# EAGLE schematic BEP33_rev1 (EAGLE 7.7.0)

## Sheet 1 of 3
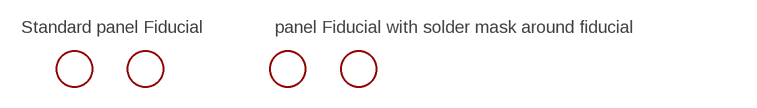
[diagram p0: schematic, sheet 1]

### Parts
FID1  FIDUCIAL  [FIDUCIAL_1MM]
FID1B  FIDUCIALFIDUCIAL_1MM_WITH_SOLDERMASK  [FIDUCIAL_1MM_WITH_SOLDERMASK]
FID2  FIDUCIAL  [FIDUCIAL_1MM]
FID2B  FIDUCIALFIDUCIAL_1MM_WITH_SOLDERMASK  [FIDUCIAL_1MM_WITH_SOLDERMASK]

### Notes on the sheet
- Standard panel Fiducial | panel Fiducial with solder mask around fiducial

## Sheet 2 of 3
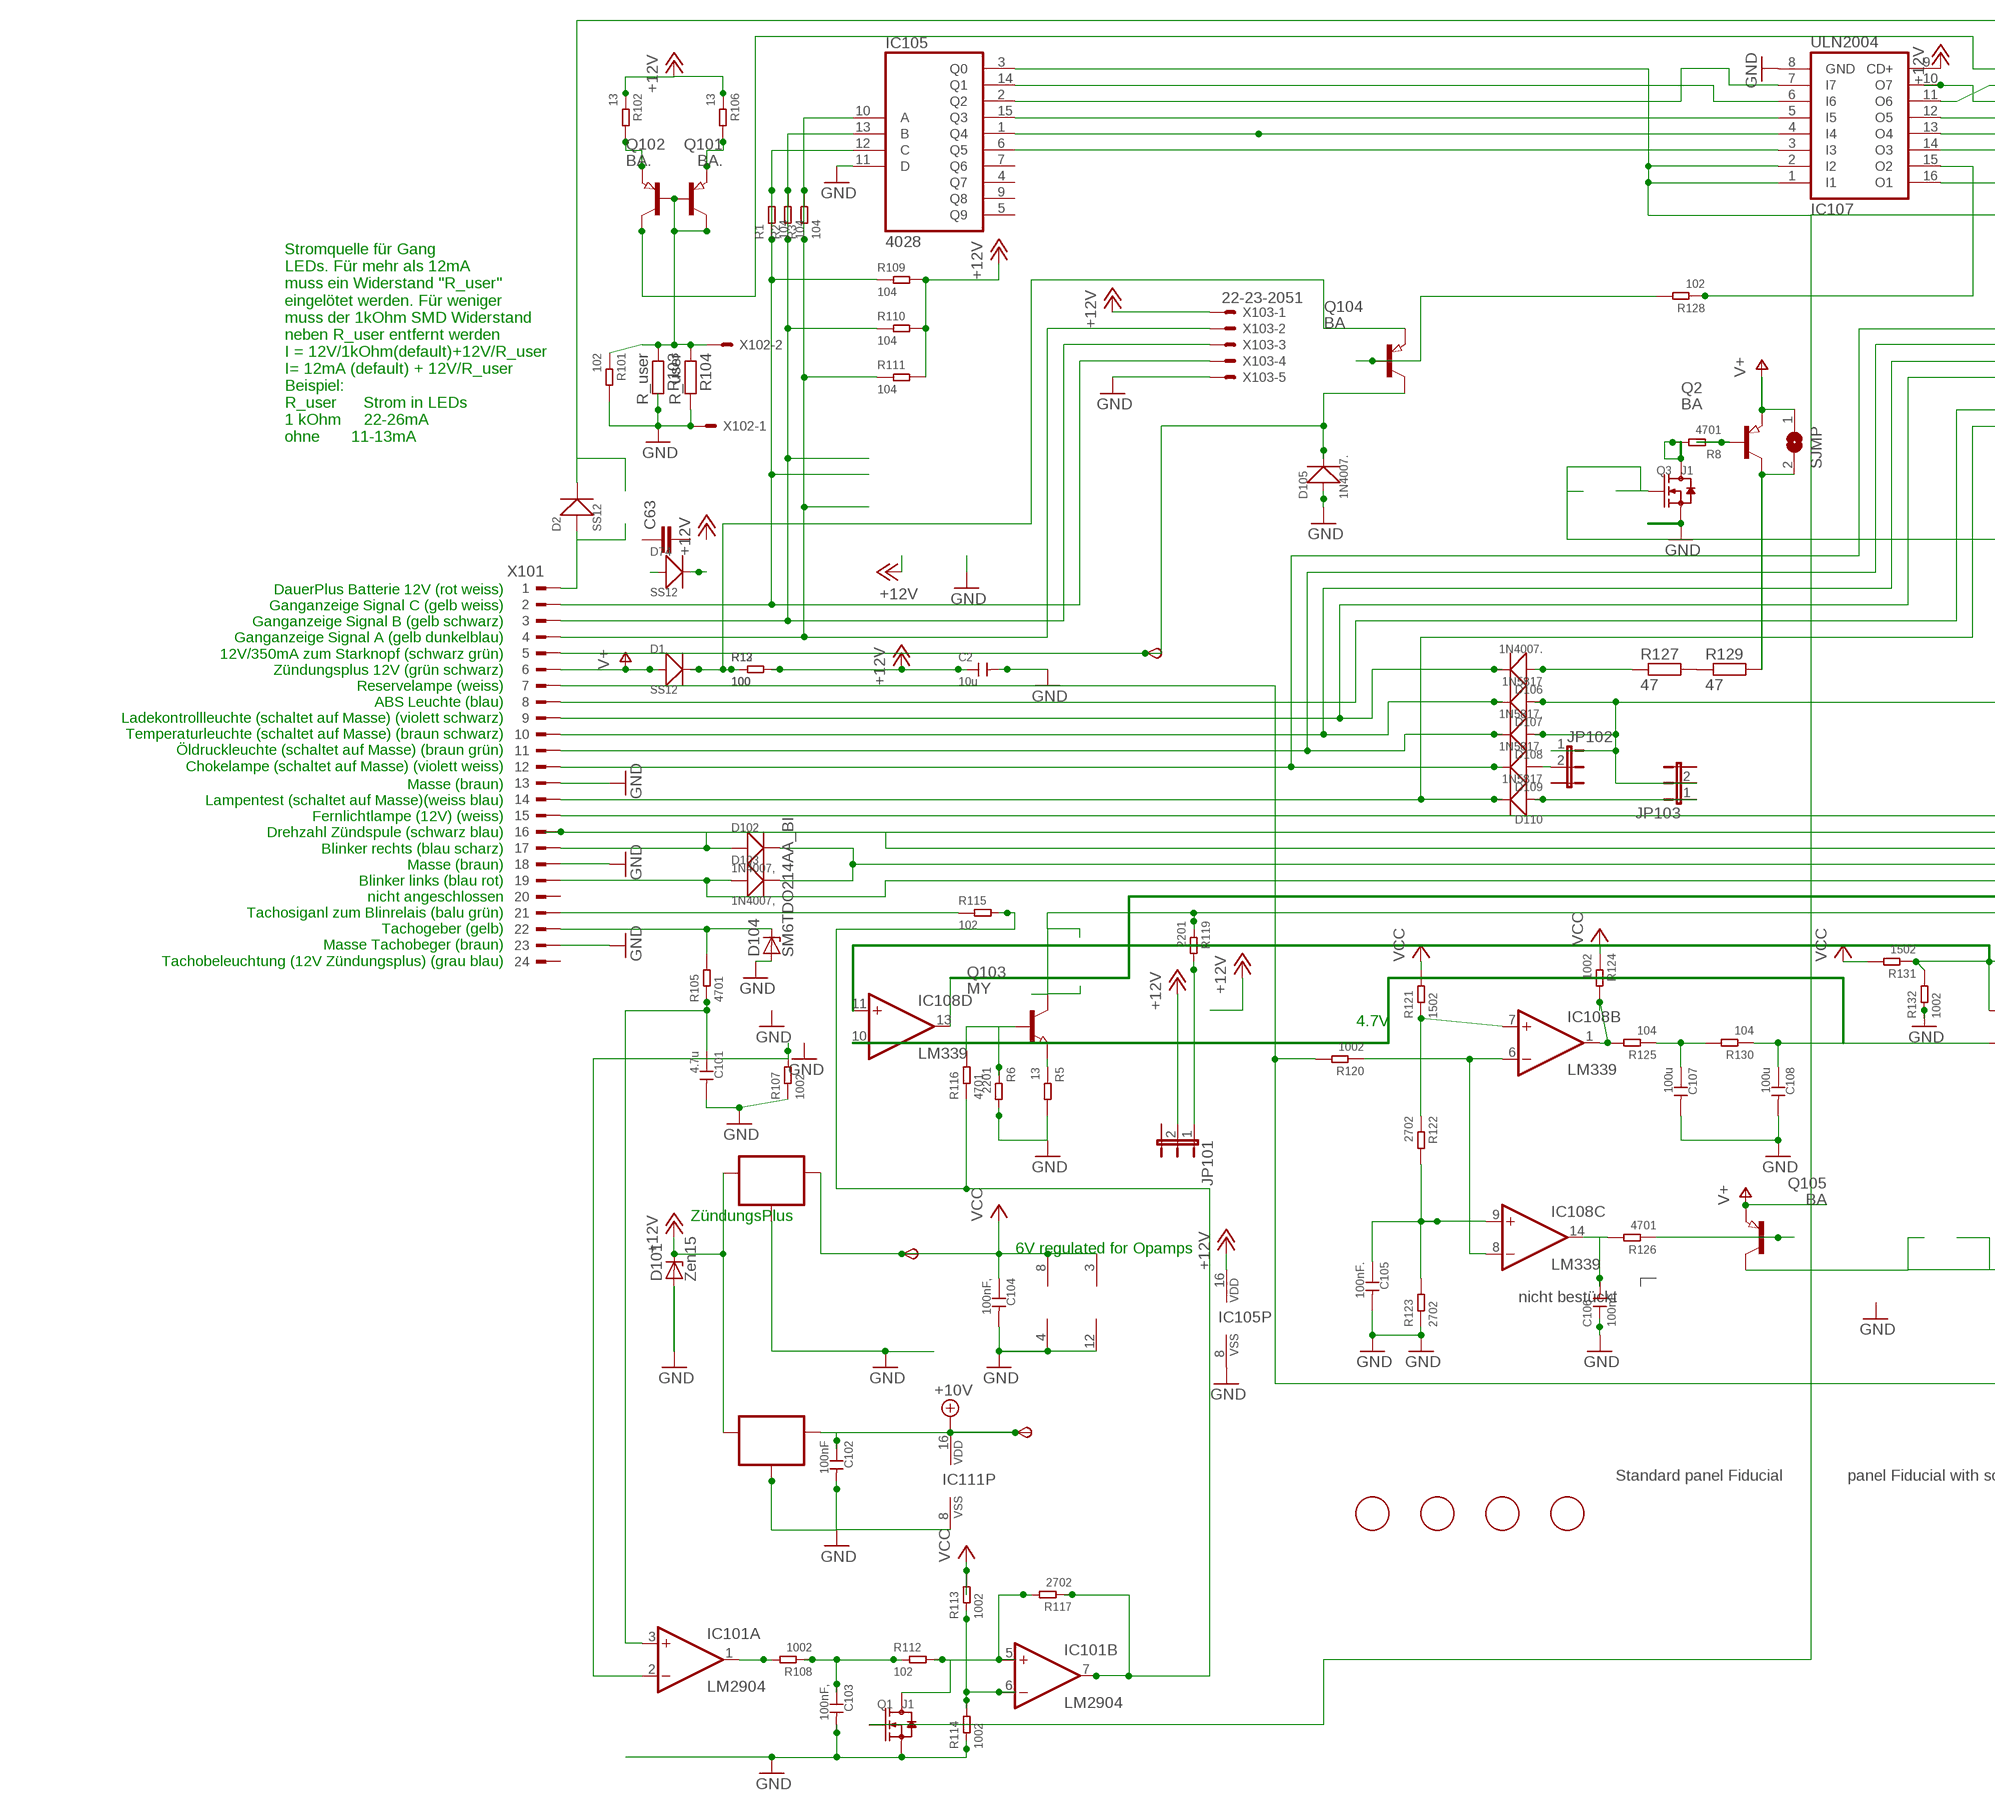
[diagram p1: schematic, sheet 2, part 1 of 2]
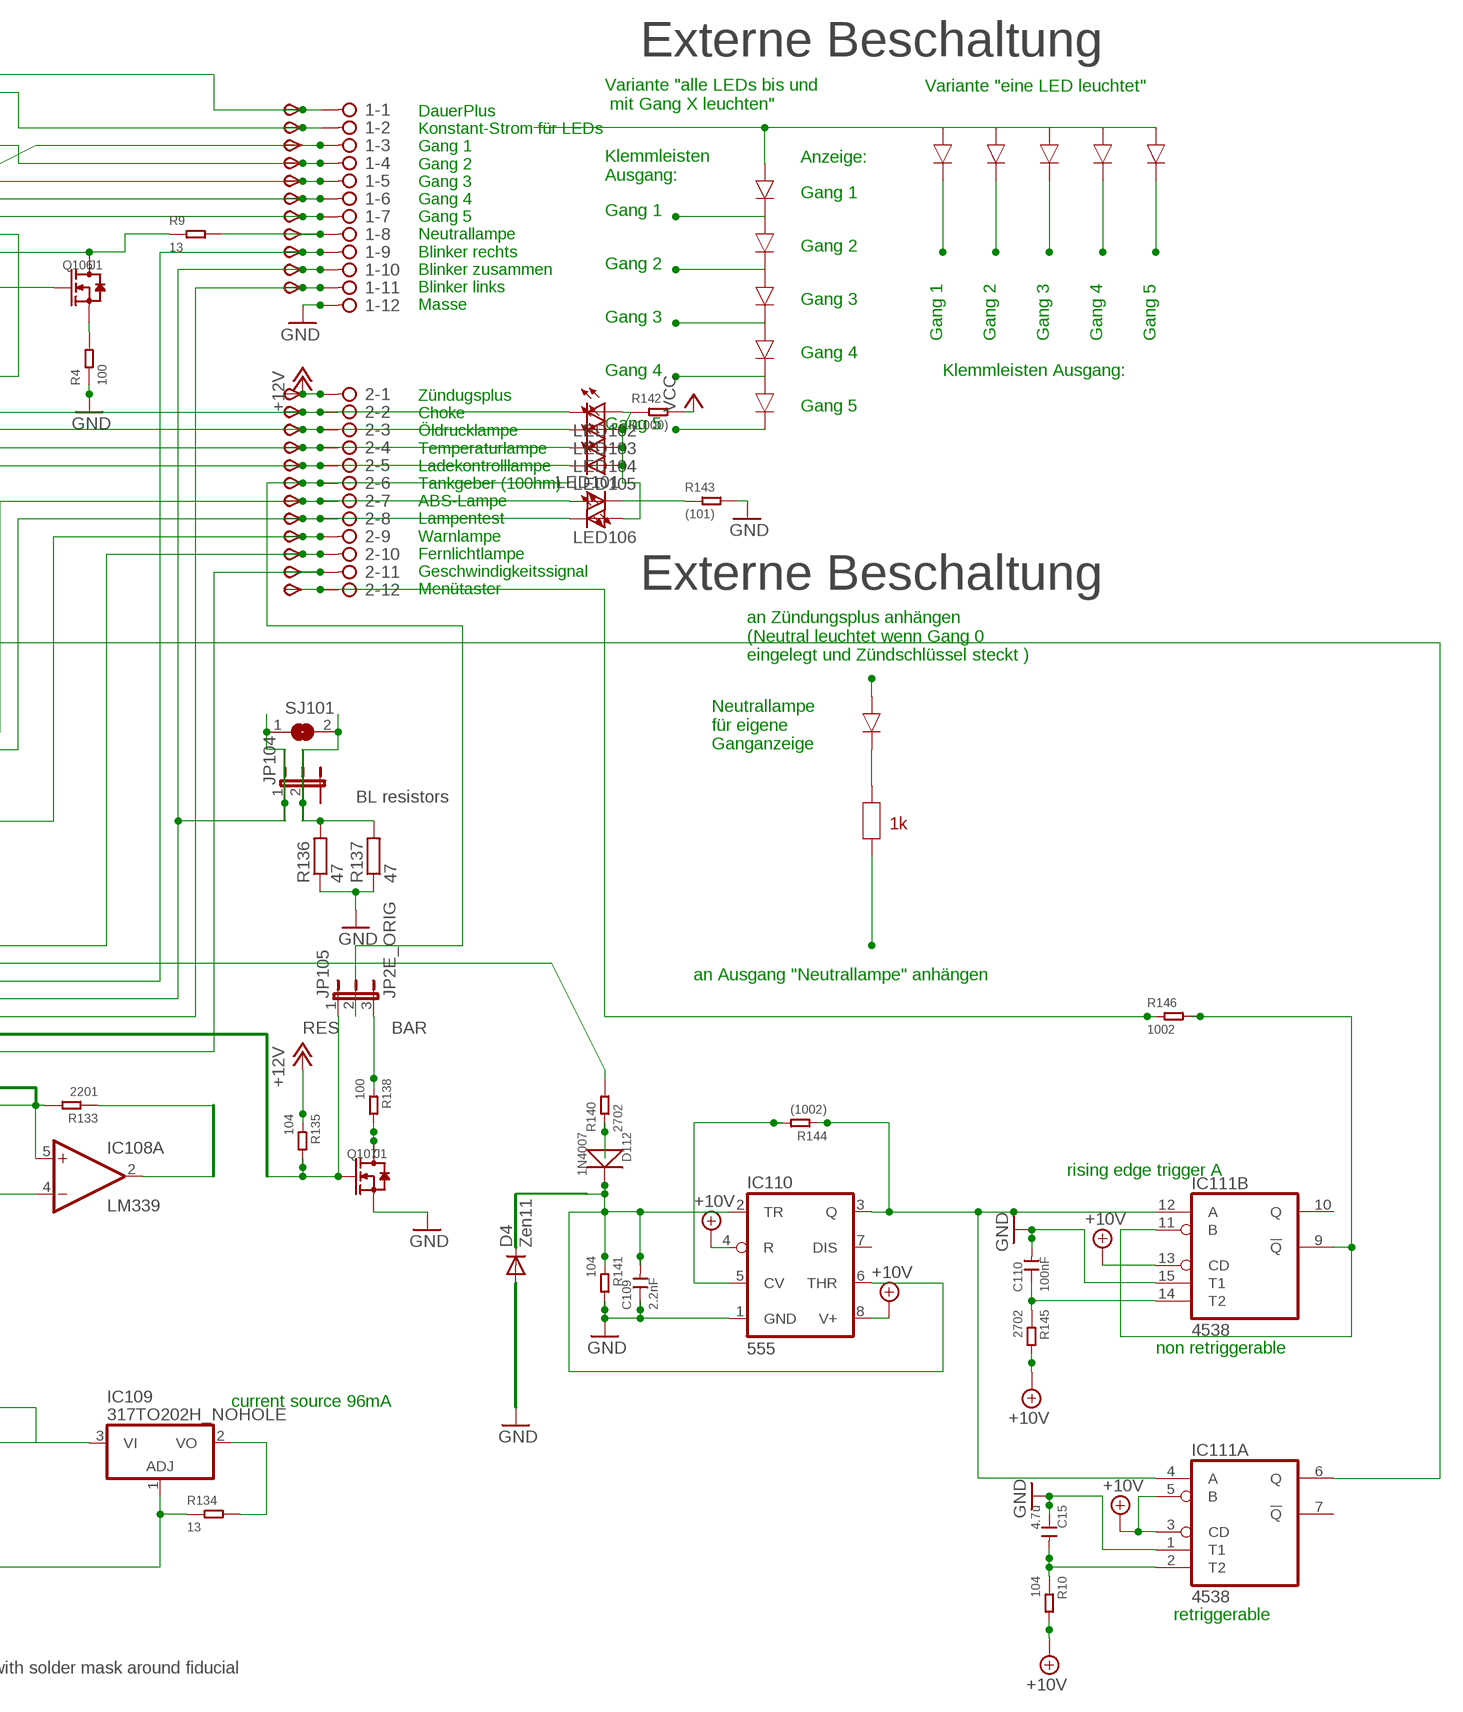
[diagram p2: schematic, sheet 2, part 2 of 2]

### Parts
1  2081-1132  [12-PIN]
2  2081-1132  [12-PIN]
6V  TPSB2.0  [B2.0]
10V  TPSB2.0  [B2.0]
C2  10u  CERAMIC-100UF-6.3V-20%-X5R(1206)  [C1206]
C15  4.7u  CERAMIC-4.7UF-25V-10%-X5R(0805)  [C0805]
C63  C-EUC1812K  [C1812K]
C101  4.7u  CERAMIC-4.7UF-25V-10%-X5R(0805)  [C0805]
C102  100nF  CERAMIC-100NF-50V-10%-X7R(0805)  [C0805]
C103  100nF,  CERAMIC-100NF-50V-10%-X7R(0805)  [C0805]
C104  100nF,  CERAMIC-100NF-50V-10%-X7R(0805)  [C0805]
C105  100nF.  CERAMIC-100NF-50V-10%-X7R(0805)  [C0805]
C106  100nF.  CERAMIC-100NF-50V-10%-X7R(0805)  [C0805]
C107  100u  CERAMIC-100UF-6.3V-20%-X5R(1206)  [C1206]
C108  100u  CERAMIC-100UF-6.3V-20%-X5R(1206)  [C1206]
C109  2.2nF  CERAMIC-100NF-50V-10%-X7R(0805)  [C0805]
C110  100nF  CERAMIC-100NF-50V-10%-X7R(0805)  [C0805]
D1  SS12  DIODE-GEN-PURPOSE-1KV-1A(DO-214AC)DO-214AC/1206  [DO-214AC_SLIM]
D2  SS12  DIODE-GEN-PURPOSE-1KV-1A(DO-214AC)DO-214AC/1206  [DO-214AC_SLIM]
D4  Zen11  CGRM4001-G  [SOD-123_MINI-SMA]
D74  SS12  DIODE-GEN-PURPOSE-1KV-1A(DO-214AC)DO-214AC/1206  [DO-214AC_SLIM]
D101  Zen15  SM6T  [DO214AA]
D102  1N4007,  DIODE-GEN-PURPOSE-1KV-1A(DO-214AC)  [DO-214AC]
D103  1N4007,  DIODE-GEN-PURPOSE-1KV-1A(DO-214AC)  [DO-214AC]
D104  SM6TDO214AA_BI  [DO214AA_BI]
D105  1N4007.  DIODE-GEN-PURPOSE-1KV-1A(DO-214AC)  [DO-214AC]
D106  1N4007.  DIODE-GEN-PURPOSE-1KV-1A(DO-214AC)  [DO-214AC]
D107  1N5817  DIODE-GEN-PURPOSE-1KV-1A(DO-214AC)DO-214AC/1206  [DO-214AC_SLIM]
D108  1N5817.  DIODE-GEN-PURPOSE-1KV-1A(DO-214AC)DO-214AC/1206  [DO-214AC_SLIM]
D109  1N5817.  DIODE-GEN-PURPOSE-1KV-1A(DO-214AC)DO-214AC/1206  [DO-214AC_SLIM]
D110  1N5817  DIODE-GEN-PURPOSE-1KV-1A(DO-214AC)DO-214AC/1206  [DO-214AC_SLIM]
D112  1N4007  DIODE-GEN-PURPOSE-1KV-1A(DO-214AC)  [DO-214AC]
FID101  FIDUCIAL  [FIDUCIAL_1MM]
FID102  FIDUCIAL  [FIDUCIAL_1MM]
FID103  FIDUCIAL  [FIDUCIAL_1MM]
FID104  FIDUCIAL  [FIDUCIAL_1MM]
IC101  LM2904  LM358D  [SO08]
IC102  78L06  78LXXSOT89_ROUND  [SOT89_ROUND]
IC104  78L10  78LXXSOT89_ROUND  [SOT89_ROUND]
IC105  4028  4028D  [SO16]
IC107  ULN2004  ULN2004AD  [SO16]
IC108  LM339  LM339D  [SO14]
IC109  317TO202H_NOHOLE  [TO220H_NOHOLE]
IC110  555  NE555D  [SO08]
IC111  4538  4538D  [SO16]
JP101  JP2EJP2_SMALLPADS  [JP2_SMALLPADS]
JP102  JP2EJP2_SMALLPADS  [JP2_SMALLPADS]
JP103  JP2EJP2_SMALLPADS  [JP2_SMALLPADS]
JP104  JP2EJP2_SMALLPADS  [JP2_SMALLPADS]
JP105  JP2E_ORIG  [JP2_ORIG_SMALLPADS]
LED101  LEDLD260  [LD260]
LED102  LEDLD260  [LD260]
LED103  LEDLD260  [LD260]
LED104  LEDLD260  [LD260]
LED105  LEDLD260  [LD260]
LED106  LEDLD260  [LD260]
Q1  J1  SMD-MOSFET-N-CH-50V-200MA-BSS138W-7-F(SOT-23)  [SOT-23]
Q2  BA  PNP-TRANSISTOR_SOT89  [SOT89]
Q3  J1  SMD-MOSFET-N-CH-50V-200MA-BSS138W-7-F(SOT-23)  [SOT-23]
Q101  BA.  PNP-TRANSISTOR_SOT89  [SOT89]
Q102  BA.  PNP-TRANSISTOR_SOT89  [SOT89]
Q103  MY  NPN-TRANSISTOR_SOT89  [SOT89]
Q104  BA  PNP-TRANSISTOR_SOT89  [SOT89]
Q105  BA  PNP-TRANSISTOR_SOT89  [SOT89]
Q106  J1  SMD-MOSFET-N-CH-50V-200MA-BSS138W-7-F(SOT-23)  [SOT-23]
Q107  J1  SMD-MOSFET-N-CH-50V-200MA-BSS138W-7-F(SOT-23)  [SOT-23]
R1  104  SMD-RES-10K-1%-1/8W(0805)  [R0805]
R2  104  SMD-RES-10K-1%-1/8W(0805)  [R0805]
R3  104  SMD-RES-10K-1%-1/8W(0805)  [R0805]
R4  100  SMD-RES-220R-5%-1/8W(0805)  [R0805]
R5  13  SMD-RES-13R-5%-1/4W(1206)  [R1206]
R6  2201  SMD-RES-1K-5%-1/8W(0805)  [R0805]
R8  4701  SMD-RES-4.7K-5%-1/8W(0805)  [R0805]
R9  13  SMD-RES-13R-5%-1/4W(1206)  [R1206]
R10  104  SMD-RES-4.7K-5%-1/8W(0805)  [R0805]
R12  100  SMD-RES-2.2K-5%-1/8W(0805)  [R0805]
R13  100  SMD-RES-2.2K-5%-1/8W(0805)  [R0805]
R101  102  SMD-RES-1K-5%-1/8W(0805)  [R0805]
R102  13  SMD-RES-13R-5%-1/4W(1206)  [R1206]
R103  R_user  R-EU_R0805  [R0805]
R104  R_user  R-EU_R0805  [R0805]
R105  4701  SMD-RES-4.7K-5%-1/8W(0805)  [R0805]
R106  13  SMD-RES-13R-5%-1/4W(1206)  [R1206]
R107  1002  SMD-RES-10K-1%-1/8W(0805)  [R0805]
R108  1002  SMD-RES-10K-1%-1/8W(0805)  [R0805]
R109  104  SMD-RES-10K-1%-1/8W(0805)  [R0805]
R110  104  SMD-RES-10K-1%-1/8W(0805)  [R0805]
R111  104  SMD-RES-10K-1%-1/8W(0805)  [R0805]
R112  102  SMD-RES-1K-5%-1/8W(0805)  [R0805]
R113  1002  SMD-RES-1K-5%-1/8W(0805)  [R0805]
R114  1002  SMD-RES-1K-5%-1/8W(0805)  [R0805]
R115  102  SMD-RES-220R-5%-1/8W(0805)  [R0805]
R116  4701  SMD-RES-4.7K-5%-1/8W(0805)  [R0805]
R117  2702  SMD-RES-4.7K-5%-1/8W(0805)  [R0805]
R119  2201  SMD-RES-2.2K-5%-1/8W(0805)  [R0805]
R120  1002  SMD-RES-10K-1%-1/8W(0805)  [R0805]
R121  1502  SMD-RES-10K-1%-1/8W(0805)  [R0805]
R122  2702  SMD-RES-4.7K-5%-1/8W(0805)  [R0805]
R123  2702  SMD-RES-4.7K-5%-1/8W(0805)  [R0805]
R124  1002  SMD-RES-10K-1%-1/8W(0805)  [R0805]
R125  104  SMD-RES-10K-1%-1/8W(0805)  [R0805]
R126  4701  SMD-RES-4.7K-5%-1/8W(0805)  [R0805]
R127  47  R-EU_V235/17_1MM  [V235/17_1MM]
R128  102  SMD-RES-1K-5%-1/8W(0805)  [R0805]
R129  47  R-EU_V235/17_1MM  [V235/17_1MM]
R130  104  SMD-RES-10K-1%-1/8W(0805)  [R0805]
R131  1502  SMD-RES-10K-1%-1/8W(0805)  [R0805]
R132  1002  SMD-RES-10K-1%-1/8W(0805)  [R0805]
R133  2201  SMD-RES-2.2K-5%-1/8W(0805)  [R0805]
R134  13  SMD-RES-13R-5%-1/4W(1206)  [R1206]
R135  104  SMD-RES-10K-1%-1/8W(0805)  [R0805]
R136  47  R-EU_V235/17_1MM  [V235/17_1MM]
R137  47  R-EU_V235/17_1MM  [V235/17_1MM]
R138  100  SMD-RES-2.2K-5%-1/8W(0805)  [R0805]
R140  2702  SMD-RES-10K-1%-1/8W(0805)  [R0805]
R141  104  SMD-RES-10K-1%-1/8W(0805)  [R0805]
R142  (1000)  SMD-RES-100R-5%-1/8W(0805)  [R0805]
R143  (101)  SMD-RES-100R-5%-1/8W(0805)  [R0805]
R144  (1002)  SMD-RES-10K-1%-1/8W(0805)  [R0805]
R145  2702  SMD-RES-4.7K-5%-1/8W(0805)  [R0805]
R146  1002  SMD-RES-4.7K-5%-1/8W(0805)  [R0805]
SJ101  SJ  [SJ]
SJMP  SJ  [SJ]
START  TPSB2.0  [B2.0]
TP1  TPSB2.0  [B2.0]
TP2  TPSB2.0  [B2.0]
TP3  TPSB2.0  [B2.0]
TP4  TPSB2.0  [B2.0]
TP5  TPSB2.0  [B2.0]
TP6  TPSB2.0  [B2.0]
TP7  TPSB2.0  [B2.0]
TP8  TPSB2.0  [B2.0]
TP9  TPSB2.0  [B2.0]
TP10  TPSB2.0  [B2.0]
TP11  TPSB2.0  [B2.0]
TP12  TPSB2.0  [B2.0]
TP13  TPSB2.0  [B2.0]
TP16  TPSB2.0  [B2.0]
TP17  TPSB2.0  [B2.0]
TP18  TPSB2.0  [B2.0]
TP19  TPSB2.0  [B2.0]
TP21  TPSB2.0  [B2.0]
TP22  TPSB2.0  [B2.0]
TP23  TPSB2.0  [B2.0]
TP24  TPSB1,27  [B1,27]
TP25  TPSB2.0  [B2.0]
TP26  TPSB2.0  [B2.0]
X101  CON_BMWV2  [24-PIN_V2]
X102  22-23-2021  [22-23-2021]
X103  22-23-2051  [22-23-2051]

### Nets
+10V: 10V.TP(PP) C102.1 IC104.1(OUT) IC110.4(R) IC110.8(V+) IC111.3(A:CD) IC111.5(A:B) IC111.13(B:CD) IC111.16(P:VDD) R10.2 R145.2 ; also sheet 3
+12V: 2.1 C2.1 D101.C IC102.3(IN) IC104.3(IN) IC105.16(VDD) IC107.9(CD+) JP101.2 R12.2 R13.2 R102.1 R106.1 R109.2 R110.2 R111.2 R135.1 TP12.TP(PP) X103.1 ; also sheet 3
+12V1: 2.11 Q103.2(C) R119.1 TP26.TP(PP)
GND: 1.12 C2.2 C15.1 C101.2 C102.2 C103.2 C104.2 C105.2 C106.1 C107.2 C108.2 C109.1 C110.2 D4.A D101.A D104.A D105.1(+) IC101.4(P:V-) IC102.2(GND) IC102.2@1(GND) IC104.2(GND) IC104.2@1(GND) IC105.8(VSS) IC105.11(D) IC107.8(GND) IC108.12(P:GND) IC110.1(GND) IC111.1(A:T1) IC111.8(P:VSS) IC111.15(B:T1) Q1.2(S) Q3.2(S) Q107.2(S) R4.1 R5.2 R6.2 R101.2 R103.2 R104.2 R107.1 R114.1 R123.1 R132.1 R136.1 R137.1 R141.2 R143.2 X101.13 X101.18 X101.23 X102.1 X103.5 ; also sheet 3
N$1: 2.9 D107.1(+) D108.1(+) JP102.1 JP103.2 TP24.TP(PP)
N$2: IC105.10(A) R3.1 R3.2 R111.1 X101.4 X103.2
N$3: IC105.13(B) R2.1 R2.2 R110.1 X101.3 X103.3
N$4: 2.7 LED101.A TP22.TP(PP) X101.8
N$5: Q101.3(E) R102.2
N$6: Q2.1(B) R8.1
N$7: IC101.2(A:-IN) R107.2
N$8: R127.2 R129.1
N$9: Q102.3(E) R106.2
N$11: D105.2(-) Q104.2(C) START.TP(PP) X101.5
N$12: 2.2 D109.2(-) LED102.K(C) TP16.TP(PP) X101.12
N$13: 2.3 D108.2(-) LED103.K(C) TP17.TP(PP) X101.11
N$14: 2.4 D107.2(-) LED104.K(C) TP18.TP(PP) X101.10
N$15: IC109.3(VI) Q105.2(C)
N$16: IC108.6(B:-IN) IC108.8(C:-IN) R120.1
N$17: IC105.12(C) R1.1 R1.2 R109.1 X101.2 X103.4
N$18: IC105.15(Q3) IC107.5(I5)
N$19: 2.8 D110.2(-) LED106.K(C) TP23.TP(PP) X101.14
N$20: 1.9 D102.1(+) TP9.TP(PP) X101.17
N$21: 1.11 D103.1(+) TP11.TP(PP) X101.19
N$22: IC111.9(B:!Q) IC111.11(B:B) R146.2
N$23: D104.C R105.2 X101.22
N$24: C101.1 IC101.3(A:+IN) R105.1
N$25: 1.6 IC107.13(O4) TP6.TP(PP)
N$26: 1.7 IC107.14(O3) TP7.TP(PP)
N$27: D1.2(-) Q104.3(E) R12.1 R13.1
N$28: 2.6 JP105.2 TP21.TP(PP)
N$29: JP101.1 R119.2
N$30: C105.1 IC108.9(C:+IN) R122.2 R123.2
N$31: C106.2 IC108.14(C:OUT) R126.2
N$32: Q3.3(D) R8.2
N$34: LED101.K(C) R143.1
N$35: IC109.1(ADJ) R120.2 R134.1 X101.7
N$36: Q105.1(B) R126.1
N$37: IC105.2(Q2) IC107.7(I7)
N$38: 1.3 IC107.11(O6) TP3.TP(PP)
N$39: 1.5 IC107.12(O5) TP5.TP(PP)
N$41: LED102.A LED103.A LED104.A LED105.A LED106.A R142.1
N$42: R140.2 X101.16
N$43: Q104.1(B) R128.2
N$44: IC105.3(Q0) IC107.1(I1) IC107.2(I2) Q1.1(G) Q106.1(G)
N$45: C107.1 R125.1 R130.2
N$46: C108.1 IC108.4(A:-IN) IC108.10(D:-IN) R130.1
N$47: IC108.5(A:+IN) IC108.11(D:+IN) R131.1 R132.2 R133.2
N$48: Q107.3(D) R138.2
N$49: IC111.6(A:Q) Q3.1(G)
N$50: IC105.1(Q4) IC107.4(I4)
N$51: R115.1 X101.21
N$52: IC107.16(O1) Q106.3(D) R9.1
N$53: 2.10 TP25.TP(PP) X101.15
N$54: D106.1(+) R127.1
N$55: 2.5 D106.2(-) LED105.K(C) TP19.TP(PP) X101.9
N$56: IC105.14(Q1) IC107.6(I6)
N$57: Q101.1(B) Q102.1(B) Q102.2(C) R101.1 R103.1 R104.1 X102.2
N$58: 1.8 R9.2 TP8.TP(PP)
N$59: 1.2 Q101.2(C) TP2.TP(PP)
N$60: IC108.13(D:OUT) JP105.1 Q107.1(G) R135.2
N$61: IC105.6(Q5) IC107.3(I3)
N$64: IC109.2(VO) R134.2
N$65: IC110.5(CV) R144.2
N$67: 1.4 IC107.10(O7) TP4.TP(PP)
N$69: 1.1 D2.2(-) TP1.TP(PP)
N$83: IC108.7(B:+IN) R121.1 R122.1
N$84: Q106.2(S) R4.2
N$85: Q103.1(B) R6.1 R116.2
N$86: IC110.3(Q) IC111.4(A:A) IC111.12(B:A) R144.1
N$87: D112.1(+) R140.1
N$88: IC107.15(O2) R128.1
N$89: C110.1 IC111.14(B:T2) R145.1
N$90: 2.12 R146.1 TP13.TP(PP)
N$91: D2.1(+) X101.1
N$92: IC101.1(A:OUT) R108.2
N$93: 1.10 D102.2(-) D103.2(-) JP104.1 SJ101.1 TP10.TP(PP)
N$94: JP104.2 R136.2 R137.2 SJ101.2
N$95: D109.1(+) JP102.2
N$96: C103.1 R108.1 R112.1
N$97: IC101.5(B:+IN) Q1.3(D) R112.2 R117.2
N$98: D110.1(+) JP103.1
N$99: JP105.3 R138.1
N$100: Q103.3(E) R5.1
N$101: IC101.6(B:-IN) R113.1 R114.2
N$102: C109.2 D4.C D112.2(-) IC110.2(TR) IC110.6(THR) R141.1
N$103: C15.2 IC111.2(A:T2) R10.1
N$104: Q2.2(C) R129.2 SJMP.2
N$107: IC101.7(B:OUT) R115.2 R116.1 R117.1
N$108: IC108.2(A:OUT) R133.1
N$168: D74.1(+)
N$169: D74.2(-)
N$580: IC108.1(B:OUT) R124.2 R125.2
V+: D1.1(+) Q2.3(E) Q105.3(E) SJMP.1 X101.6 ; also sheet 3
VCC: 6V.TP(PP) C104.1 IC101.8(P:V+) IC102.1(OUT) IC108.3(P:V+) R113.2 R121.2 R124.1 R131.2 R142.2 ; also sheet 3
Unconnected: C63.1 C63.2 IC105.4(Q7) IC105.5(Q9) IC105.7(Q6) IC105.9(Q8) IC110.7(DIS) IC111.7(A:!Q) IC111.10(B:Q) X101.20 X101.24

### Notes on the sheet
- Externe Beschaltung
- Variante "eine LED leuchtet"
- Variante "alle LEDs bis und
   mit Gang X leuchten"
- Anzeige:
- Klemmleisten
  Ausgang:
- Gang 1
- DauerPlus
  Konstant-Strom für LEDs
  Gang 1
  Gang 2
  Gang 3
  Gang 4
  Gang 5
  Neutrallampe
  Blinker rechts
  Blinker zusammen
  Blinker links
  Masse
- Gang 1
- Gang 2
- Gang 2
- Gang 3
- Gang 3
- Gang 1 | Gang 2 | Gang 3 | Gang 4 | Gang 5
- Gang 4
- Gang 4 | Klemmleisten Ausgang:
- Gang 5
- Gang 5
- Zündugsplus
  Choke
  Öldrucklampe
  Temperaturlampe
  Ladekontrolllampe
  Tankgeber (100hm)
  ABS-Lampe
  Lampentest
  Warnlampe
  Fernlichtlampe
  Geschwindigkeitssignal
  Menütaster
- Stromquelle für Gang
  LEDs. Für mehr als 12mA
  muss ein Widerstand "R_user"
  eingelötet werden. Für weniger
  muss der 1kOhm SMD Widerstand
  neben R_user entfernt werden
  I = 12V/1kOhm(default)+12V/R_user
  I= 12mA (default) + 12V/R_user
  Beispiel:
  R_user      Strom in LEDs
  1 kOhm     22-26mA
  ohne       11-13mA
- Externe Beschaltung
- an Zündungsplus anhängen
  (Neutral leuchtet wenn Gang 0
  eingelegt und Zündschlüssel steckt )
- Neutrallampe
  für eigene
  Ganganzeige
- DauerPlus Batterie 12V (rot weiss)
  Ganganzeige Signal C (gelb weiss)
  Ganganzeige Signal B (gelb schwarz)
  Ganganzeige Signal A (gelb dunkelblau)
  12V/350mA zum Starknopf (schwarz grün)
  Zündungsplus 12V (grün schwarz)
  Reservelampe (weiss)
  ABS Leuchte (blau)
  Ladekontrollleuchte (schaltet auf Masse) (violett schwarz)
  Temperaturleuchte (schaltet auf Masse) (braun schwarz)
  Öldruckleuchte (schaltet auf Masse) (braun grün)
  Chokelampe (schaltet auf Masse) (violett weiss)
- BL resistors
- 1k
- an Ausgang "Neutrallampe" anhängen
- Masse (braun)
  Lampentest (schaltet auf Masse)(weiss blau)
  Fernlichtlampe (12V) (weiss)
  Drehzahl Zündspule (schwarz blau)
  Blinker rechts (blau scharz)
  Masse (braun)
  Blinker links (blau rot)
  nicht angeschlossen
  Tachosiganl zum Blinrelais (balu grün)
  Tachogeber (gelb)
  Masse Tachobeger (braun)
  Tachobeleuchtung (12V Zündungsplus) (grau blau)
- RES | BAR
- 4.7V | rising edge trigger A
- non retriggerable
- ZündungsPlus
- current source 96mA
- 6V regulated for Opamps
- nicht bestückt
- retriggerable
- Standard panel Fiducial | panel Fiducial with solder mask around fiducial

## Sheet 3 of 3
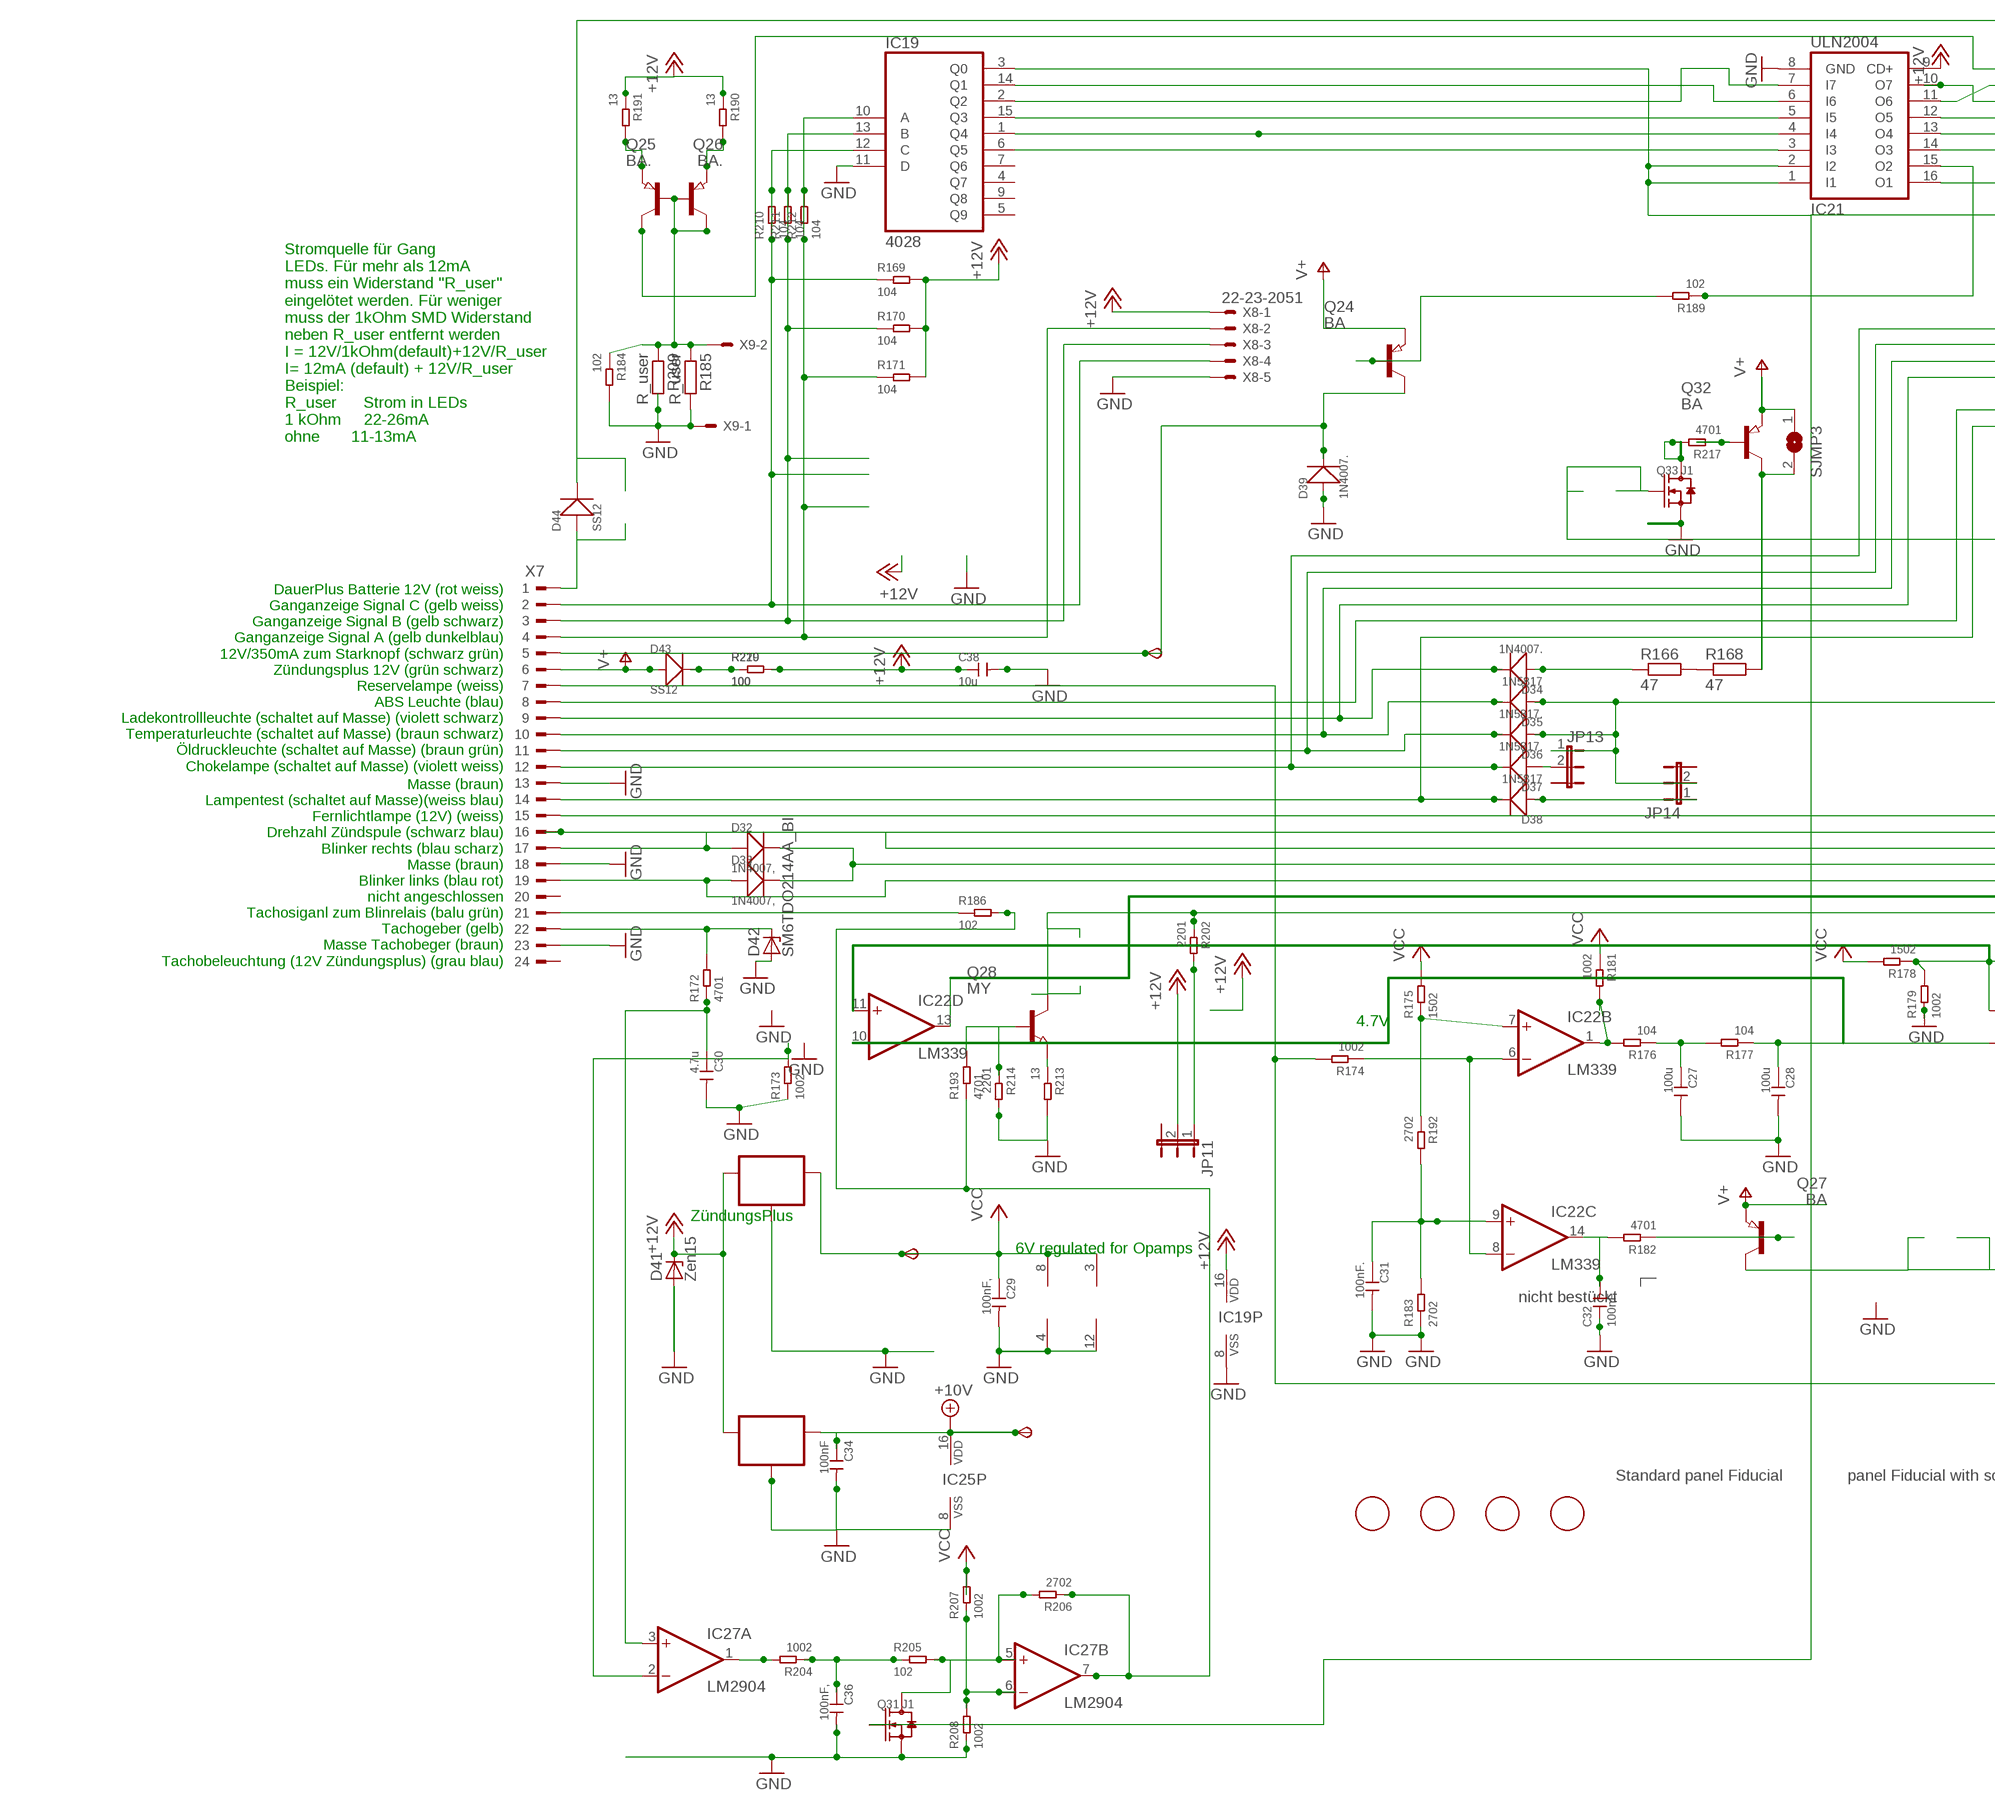
[diagram p3: schematic, sheet 3, part 1 of 2]
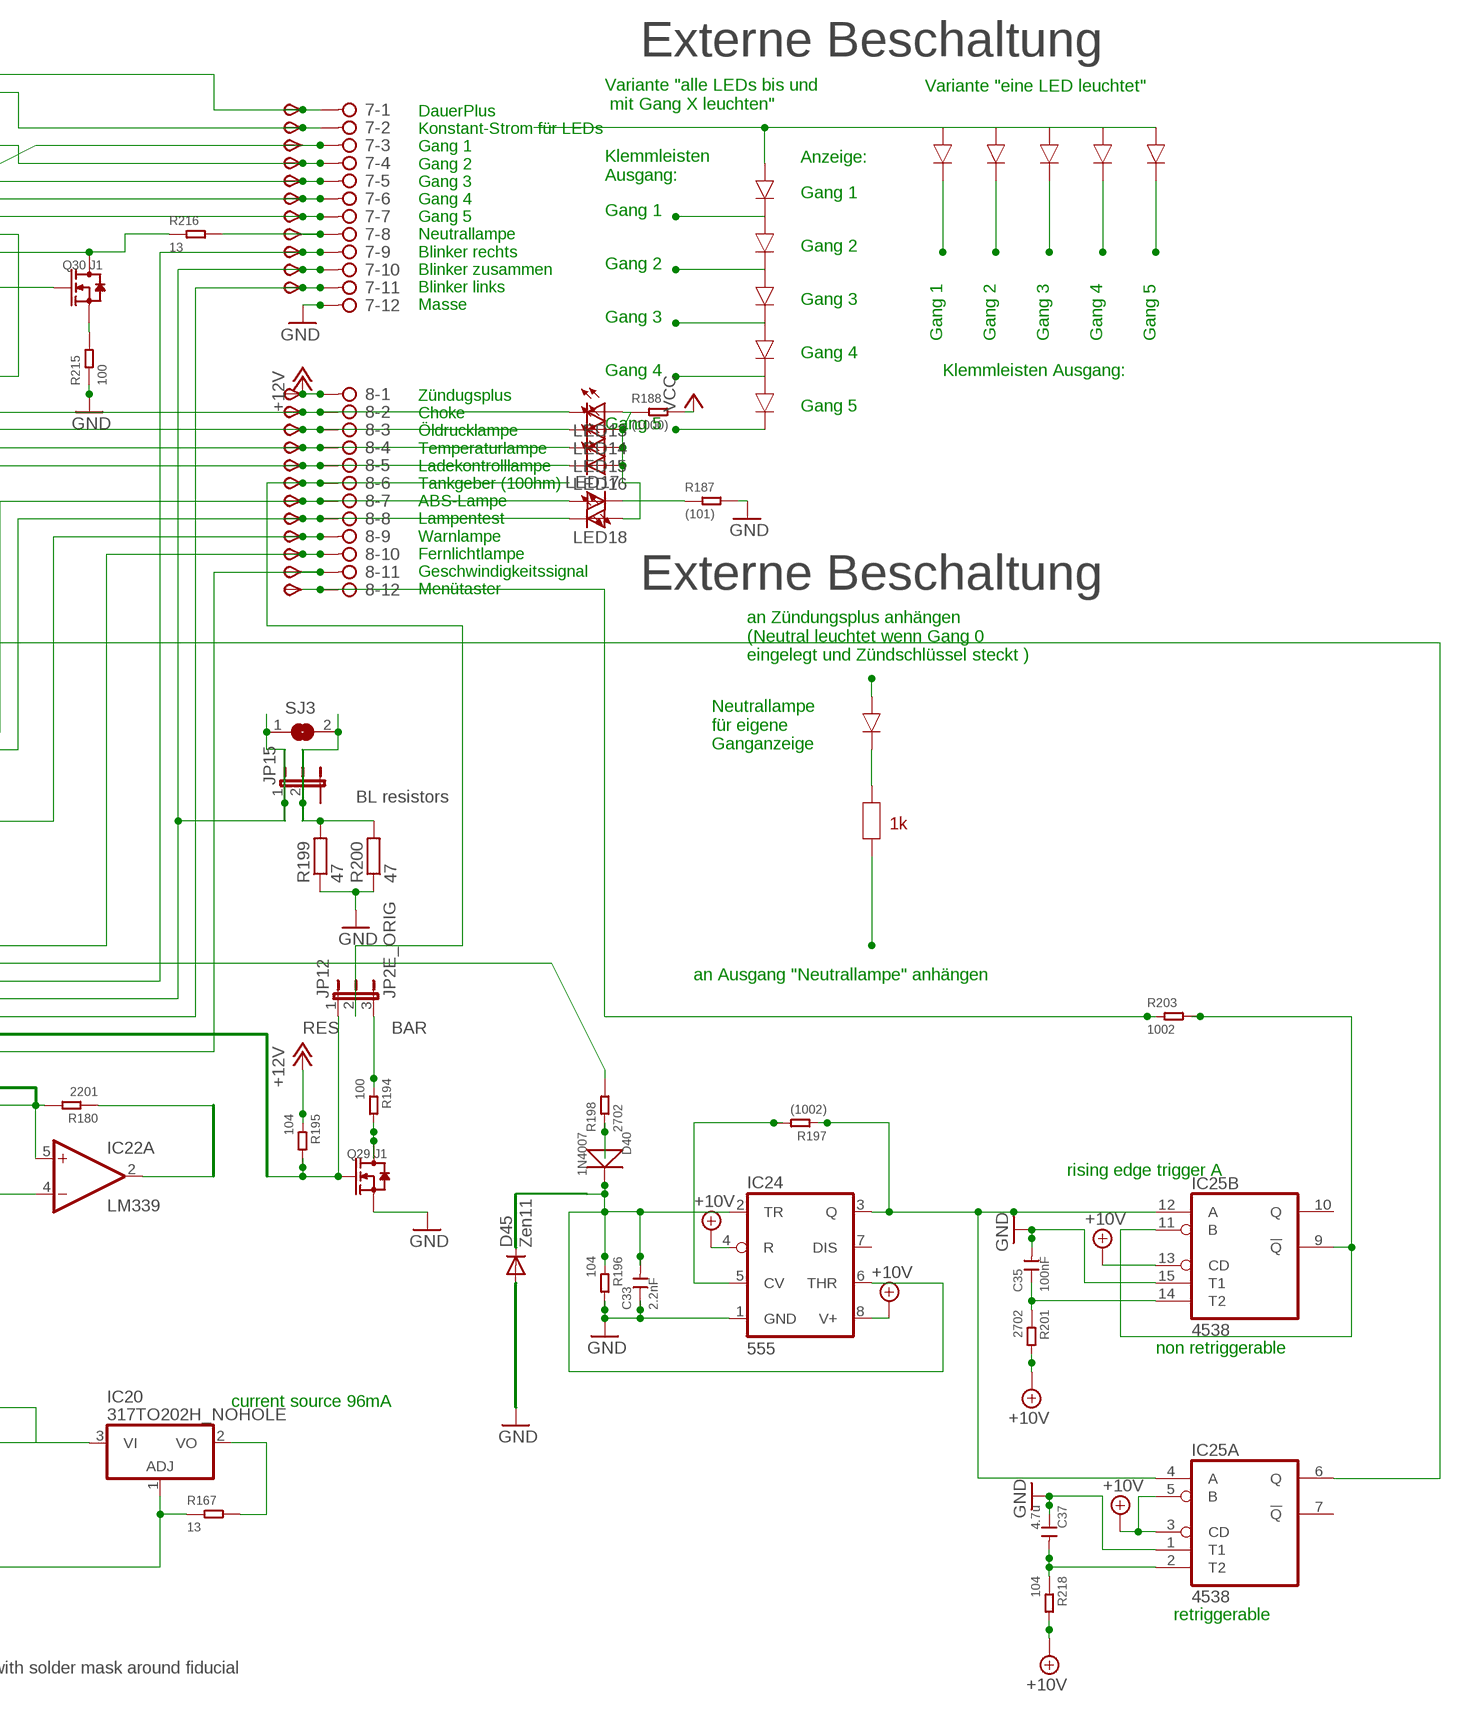
[diagram p4: schematic, sheet 3, part 2 of 2]

### Parts
6V3  TPSB2.0  [B2.0]
7  2081-1132  [12-PIN]
8  2081-1132  [12-PIN]
10V3  TPSB2.0  [B2.0]
C27  100u  CERAMIC-100UF-6.3V-20%-X5R(1206)  [C1206]
C28  100u  CERAMIC-100UF-6.3V-20%-X5R(1206)  [C1206]
C29  100nF,  CERAMIC-100NF-50V-10%-X7R(0805)  [C0805]
C30  4.7u  CERAMIC-4.7UF-25V-10%-X5R(0805)  [C0805]
C31  100nF.  CERAMIC-100NF-50V-10%-X7R(0805)  [C0805]
C32  100nF.  CERAMIC-100NF-50V-10%-X7R(0805)  [C0805]
C33  2.2nF  CERAMIC-100NF-50V-10%-X7R(0805)  [C0805]
C34  100nF  CERAMIC-100NF-50V-10%-X7R(0805)  [C0805]
C35  100nF  CERAMIC-100NF-50V-10%-X7R(0805)  [C0805]
C36  100nF,  CERAMIC-100NF-50V-10%-X7R(0805)  [C0805]
C37  4.7u  CERAMIC-4.7UF-25V-10%-X5R(0805)  [C0805]
C38  10u  CERAMIC-100UF-6.3V-20%-X5R(1206)  [C1206]
D32  1N4007,  DIODE-GEN-PURPOSE-1KV-1A(DO-214AC)  [DO-214AC]
D33  1N4007,  DIODE-GEN-PURPOSE-1KV-1A(DO-214AC)  [DO-214AC]
D34  1N4007.  DIODE-GEN-PURPOSE-1KV-1A(DO-214AC)  [DO-214AC]
D35  1N5817  DIODE-GEN-PURPOSE-1KV-1A(DO-214AC)DO-214AC/1206  [DO-214AC_SLIM]
D36  1N5817.  DIODE-GEN-PURPOSE-1KV-1A(DO-214AC)DO-214AC/1206  [DO-214AC_SLIM]
D37  1N5817.  DIODE-GEN-PURPOSE-1KV-1A(DO-214AC)DO-214AC/1206  [DO-214AC_SLIM]
D38  1N5817  DIODE-GEN-PURPOSE-1KV-1A(DO-214AC)DO-214AC/1206  [DO-214AC_SLIM]
D39  1N4007.  DIODE-GEN-PURPOSE-1KV-1A(DO-214AC)  [DO-214AC]
D40  1N4007  DIODE-GEN-PURPOSE-1KV-1A(DO-214AC)  [DO-214AC]
D41  Zen15  SM6T  [DO214AA]
D42  SM6TDO214AA_BI  [DO214AA_BI]
D43  SS12  DIODE-GEN-PURPOSE-1KV-1A(DO-214AC)DO-214AC/1206  [DO-214AC_SLIM]
D44  SS12  DIODE-GEN-PURPOSE-1KV-1A(DO-214AC)DO-214AC/1206  [DO-214AC_SLIM]
D45  Zen11  CGRM4001-G  [SOD-123_MINI-SMA]
FID11  FIDUCIAL  [FIDUCIAL_1MM]
FID12  FIDUCIAL  [FIDUCIAL_1MM]
FID13  FIDUCIAL  [FIDUCIAL_1MM]
FID14  FIDUCIAL  [FIDUCIAL_1MM]
IC19  4028  4028D  [SO16]
IC20  317TO202H_NOHOLE  [TO220H_NOHOLE]
IC21  ULN2004  ULN2004AD  [SO16]
IC22  LM339  LM339D  [SO14]
IC23  78L06  78LXXSOT89_ROUND  [SOT89_ROUND]
IC24  555  NE555D  [SO08]
IC25  4538  4538D  [SO16]
IC26  78L10  78LXXSOT89_ROUND  [SOT89_ROUND]
IC27  LM2904  LM358D  [SO08]
JP11  JP2EJP2_SMALLPADS  [JP2_SMALLPADS]
JP12  JP2E_ORIG  [JP2_ORIG_SMALLPADS]
JP13  JP2EJP2_SMALLPADS  [JP2_SMALLPADS]
JP14  JP2EJP2_SMALLPADS  [JP2_SMALLPADS]
JP15  JP2EJP2_SMALLPADS  [JP2_SMALLPADS]
LED13  LEDLD260  [LD260]
LED14  LEDLD260  [LD260]
LED15  LEDLD260  [LD260]
LED16  LEDLD260  [LD260]
LED17  LEDLD260  [LD260]
LED18  LEDLD260  [LD260]
Q24  BA  PNP-TRANSISTOR_SOT89  [SOT89]
Q25  BA.  PNP-TRANSISTOR_SOT89  [SOT89]
Q26  BA.  PNP-TRANSISTOR_SOT89  [SOT89]
Q27  BA  PNP-TRANSISTOR_SOT89  [SOT89]
Q28  MY  NPN-TRANSISTOR_SOT89  [SOT89]
Q29  J1  SMD-MOSFET-N-CH-50V-200MA-BSS138W-7-F(SOT-23)  [SOT-23]
Q30  J1  SMD-MOSFET-N-CH-50V-200MA-BSS138W-7-F(SOT-23)  [SOT-23]
Q31  J1  SMD-MOSFET-N-CH-50V-200MA-BSS138W-7-F(SOT-23)  [SOT-23]
Q32  BA  PNP-TRANSISTOR_SOT89  [SOT89]
Q33  J1  SMD-MOSFET-N-CH-50V-200MA-BSS138W-7-F(SOT-23)  [SOT-23]
R166  47  R-EU_V235/17_1MM  [V235/17_1MM]
R167  13  SMD-RES-13R-5%-1/4W(1206)  [R1206]
R168  47  R-EU_V235/17_1MM  [V235/17_1MM]
R169  104  SMD-RES-10K-1%-1/8W(0805)  [R0805]
R170  104  SMD-RES-10K-1%-1/8W(0805)  [R0805]
R171  104  SMD-RES-10K-1%-1/8W(0805)  [R0805]
R172  4701  SMD-RES-4.7K-5%-1/8W(0805)  [R0805]
R173  1002  SMD-RES-10K-1%-1/8W(0805)  [R0805]
R174  1002  SMD-RES-10K-1%-1/8W(0805)  [R0805]
R175  1502  SMD-RES-10K-1%-1/8W(0805)  [R0805]
R176  104  SMD-RES-10K-1%-1/8W(0805)  [R0805]
R177  104  SMD-RES-10K-1%-1/8W(0805)  [R0805]
R178  1502  SMD-RES-10K-1%-1/8W(0805)  [R0805]
R179  1002  SMD-RES-10K-1%-1/8W(0805)  [R0805]
R180  2201  SMD-RES-2.2K-5%-1/8W(0805)  [R0805]
R181  1002  SMD-RES-10K-1%-1/8W(0805)  [R0805]
R182  4701  SMD-RES-4.7K-5%-1/8W(0805)  [R0805]
R183  2702  SMD-RES-4.7K-5%-1/8W(0805)  [R0805]
R184  102  SMD-RES-1K-5%-1/8W(0805)  [R0805]
R185  R_user  R-EU_R0805  [R0805]
R186  102  SMD-RES-220R-5%-1/8W(0805)  [R0805]
R187  (101)  SMD-RES-100R-5%-1/8W(0805)  [R0805]
R188  (1000)  SMD-RES-100R-5%-1/8W(0805)  [R0805]
R189  102  SMD-RES-1K-5%-1/8W(0805)  [R0805]
R190  13  SMD-RES-13R-5%-1/4W(1206)  [R1206]
R191  13  SMD-RES-13R-5%-1/4W(1206)  [R1206]
R192  2702  SMD-RES-4.7K-5%-1/8W(0805)  [R0805]
R193  4701  SMD-RES-4.7K-5%-1/8W(0805)  [R0805]
R194  100  SMD-RES-2.2K-5%-1/8W(0805)  [R0805]
R195  104  SMD-RES-10K-1%-1/8W(0805)  [R0805]
R196  104  SMD-RES-10K-1%-1/8W(0805)  [R0805]
R197  (1002)  SMD-RES-10K-1%-1/8W(0805)  [R0805]
R198  2702  SMD-RES-10K-1%-1/8W(0805)  [R0805]
R199  47  R-EU_V235/17_1MM  [V235/17_1MM]
R200  47  R-EU_V235/17_1MM  [V235/17_1MM]
R201  2702  SMD-RES-4.7K-5%-1/8W(0805)  [R0805]
R202  2201  SMD-RES-2.2K-5%-1/8W(0805)  [R0805]
R203  1002  SMD-RES-4.7K-5%-1/8W(0805)  [R0805]
R204  1002  SMD-RES-10K-1%-1/8W(0805)  [R0805]
R205  102  SMD-RES-1K-5%-1/8W(0805)  [R0805]
R206  2702  SMD-RES-4.7K-5%-1/8W(0805)  [R0805]
R207  1002  SMD-RES-1K-5%-1/8W(0805)  [R0805]
R208  1002  SMD-RES-1K-5%-1/8W(0805)  [R0805]
R209  R_user  R-EU_R0805  [R0805]
R210  104  SMD-RES-10K-1%-1/8W(0805)  [R0805]
R211  104  SMD-RES-10K-1%-1/8W(0805)  [R0805]
R212  104  SMD-RES-10K-1%-1/8W(0805)  [R0805]
R213  13  SMD-RES-13R-5%-1/4W(1206)  [R1206]
R214  2201  SMD-RES-1K-5%-1/8W(0805)  [R0805]
R215  100  SMD-RES-220R-5%-1/8W(0805)  [R0805]
R216  13  SMD-RES-13R-5%-1/4W(1206)  [R1206]
R217  4701  SMD-RES-4.7K-5%-1/8W(0805)  [R0805]
R218  104  SMD-RES-4.7K-5%-1/8W(0805)  [R0805]
R219  100  SMD-RES-2.2K-5%-1/8W(0805)  [R0805]
R220  100  SMD-RES-2.2K-5%-1/8W(0805)  [R0805]
SJ3  SJ  [SJ]
SJMP3  SJ  [SJ]
START3  TPSB2.0  [B2.0]
TP70  TPSB2.0  [B2.0]
TP71  TPSB2.0  [B2.0]
TP72  TPSB2.0  [B2.0]
TP73  TPSB2.0  [B2.0]
TP74  TPSB2.0  [B2.0]
TP75  TPSB2.0  [B2.0]
TP76  TPSB2.0  [B2.0]
TP77  TPSB2.0  [B2.0]
TP78  TPSB2.0  [B2.0]
TP79  TPSB2.0  [B2.0]
TP80  TPSB2.0  [B2.0]
TP81  TPSB2.0  [B2.0]
TP82  TPSB2.0  [B2.0]
TP83  TPSB2.0  [B2.0]
TP84  TPSB2.0  [B2.0]
TP85  TPSB2.0  [B2.0]
TP86  TPSB2.0  [B2.0]
TP87  TPSB2.0  [B2.0]
TP88  TPSB1,27  [B1,27]
TP89  TPSB2.0  [B2.0]
TP90  TPSB2.0  [B2.0]
TP91  TPSB2.0  [B2.0]
TP92  TPSB2.0  [B2.0]
X7  CON_BMWV2  [24-PIN_V2]
X8  22-23-2051  [22-23-2051]
X9  22-23-2021  [22-23-2021]

### Nets
+10V: 10V3.TP(PP) C34.1 IC24.4(R) IC24.8(V+) IC25.3(A:CD) IC25.5(A:B) IC25.13(B:CD) IC25.16(P:VDD) IC26.1(OUT) R201.2 R218.2 ; also sheet 2
+12V: 8.1 C38.1 D41.C IC19.16(VDD) IC21.9(CD+) IC23.3(IN) IC26.3(IN) JP11.2 R169.2 R170.2 R171.2 R190.1 R191.1 R195.1 R219.2 R220.2 TP91.TP(PP) X8.1 ; also sheet 2
+12V4: 8.11 Q28.2(C) R202.1 TP90.TP(PP)
GND: 7.12 C27.2 C28.2 C29.2 C30.2 C31.2 C32.1 C33.1 C34.2 C35.2 C36.2 C37.1 C38.2 D39.1(+) D41.A D42.A D45.A IC19.8(VSS) IC19.11(D) IC21.8(GND) IC22.12(P:GND) IC23.2(GND) IC23.2@1(GND) IC24.1(GND) IC25.1(A:T1) IC25.8(P:VSS) IC25.15(B:T1) IC26.2(GND) IC26.2@1(GND) IC27.4(P:V-) Q29.2(S) Q31.2(S) Q33.2(S) R173.1 R179.1 R183.1 R184.2 R185.2 R187.2 R196.2 R199.1 R200.1 R208.1 R209.2 R213.2 R214.2 R215.1 X7.13 X7.18 X7.23 X8.5 X9.1 ; also sheet 2
N$701: R166.2 R168.1
N$702: 8.9 D35.1(+) D36.1(+) JP13.1 JP14.2 TP88.TP(PP)
N$703: IC19.10(A) R171.1 R212.1 R212.2 X7.4 X8.2
N$704: IC19.13(B) R170.1 R211.1 R211.2 X7.3 X8.3
N$705: D39.2(-) Q24.2(C) START3.TP(PP) X7.5
N$706: IC19.12(C) R169.1 R210.1 R210.2 X7.2 X8.4
N$707: 8.7 LED17.A TP86.TP(PP) X7.8
N$708: 8.2 D37.2(-) LED13.K(C) TP81.TP(PP) X7.12
N$709: 8.3 D36.2(-) LED14.K(C) TP82.TP(PP) X7.11
N$710: 8.4 D35.2(-) LED15.K(C) TP83.TP(PP) X7.10
N$711: 8.8 D38.2(-) LED18.K(C) TP87.TP(PP) X7.14
N$712: 7.9 D32.1(+) TP78.TP(PP) X7.17
N$713: 7.11 D33.1(+) TP80.TP(PP) X7.19
N$714: D42.C R172.2 X7.22
N$715: C30.1 IC27.3(A:+IN) R172.1
N$716: IC22.1(B:OUT) R176.2 R181.2
N$717: C27.1 R176.1 R177.2
N$718: C28.1 IC22.4(A:-IN) IC22.10(D:-IN) R177.1
N$719: IC22.5(A:+IN) IC22.11(D:+IN) R178.1 R179.2 R180.2
N$720: C31.1 IC22.9(C:+IN) R183.2 R192.2
N$721: C32.2 IC22.14(C:OUT) R182.2
N$722: Q27.1(B) R182.1
N$723: IC19.2(Q2) IC21.7(I7)
N$724: 7.5 IC21.12(O5) TP74.TP(PP)
N$725: IC19.1(Q4) IC21.4(I4)
N$726: 8.10 TP89.TP(PP) X7.15
N$727: 8.5 D34.2(-) LED16.K(C) TP84.TP(PP) X7.9
N$728: D34.1(+) R166.1
N$729: IC19.6(Q5) IC21.3(I3)
N$730: 7.4 IC21.10(O7) TP73.TP(PP)
N$731: IC20.1(ADJ) R167.1 R174.2 X7.7
N$732: IC22.6(B:-IN) IC22.8(C:-IN) R174.1
N$733: 7.2 Q26.2(C) TP71.TP(PP)
N$734: 7.1 D44.2(-) TP70.TP(PP)
N$748: R198.2 X7.16
N$749: IC19.15(Q3) IC21.5(I5)
N$750: 7.6 IC21.13(O4) TP75.TP(PP)
N$751: 7.7 IC21.14(O3) TP76.TP(PP)
N$752: 8.6 JP12.2 TP85.TP(PP)
N$753: LED17.K(C) R187.1
N$754: LED13.A LED14.A LED15.A LED16.A LED18.A R188.1
N$755: Q24.1(B) R189.2
N$756: IC19.3(Q0) IC21.1(I1) IC21.2(I2) Q30.1(G) Q31.1(G)
N$757: IC19.14(Q1) IC21.6(I6)
N$758: 7.3 IC21.11(O6) TP72.TP(PP)
N$759: Q25.1(B) Q25.2(C) Q26.1(B) R184.1 R185.1 R209.1 X9.2
N$760: Q26.3(E) R191.2
N$761: Q25.3(E) R190.2
N$762: IC22.7(B:+IN) R175.1 R192.1
N$763: IC27.2(A:-IN) R173.2
N$764: Q28.1(B) R193.2 R214.1
N$765: Q29.3(D) R194.2
N$766: IC20.2(VO) R167.2
N$767: IC20.3(VI) Q27.2(C)
N$768: IC24.5(CV) R197.2
N$769: IC24.3(Q) IC25.4(A:A) IC25.12(B:A) R197.1
N$770: D40.1(+) R198.1
N$771: 7.10 D32.2(-) D33.2(-) JP15.1 SJ3.1 TP79.TP(PP)
N$772: JP15.2 R199.2 R200.2 SJ3.2
N$773: IC25.9(B:!Q) IC25.11(B:B) R203.2
N$774: C35.1 IC25.14(B:T2) R201.1
N$775: JP11.1 R202.2
N$776: IC21.15(O2) R189.1
N$777: 8.12 R203.1 TP92.TP(PP)
N$778: D37.1(+) JP13.2
N$779: IC27.1(A:OUT) R204.2
N$780: C36.1 R204.1 R205.1
N$781: IC27.5(B:+IN) Q31.3(D) R205.2 R206.2
N$782: IC27.6(B:-IN) R207.1 R208.2
N$783: D38.1(+) JP14.1
N$784: JP12.3 R194.1
N$785: IC22.13(D:OUT) JP12.1 Q29.1(G) R195.2
N$786: R186.1 X7.21
N$787: IC21.16(O1) Q30.3(D) R216.1
N$788: D43.2(-) R219.1 R220.1
N$789: 7.8 R216.2 TP77.TP(PP)
N$790: Q30.2(S) R215.2
N$791: D44.1(+) X7.1
N$792: Q28.3(E) R213.1
N$793: C33.2 D40.2(-) D45.C IC24.2(TR) IC24.6(THR) R196.1
N$794: Q32.1(B) R217.1
N$795: Q33.3(D) R217.2
N$796: Q32.2(C) R168.2 SJMP3.2
N$797: IC27.7(B:OUT) R186.2 R193.1 R206.1
N$798: IC22.2(A:OUT) R180.1
N$799: IC25.6(A:Q) Q33.1(G)
N$800: C37.2 IC25.2(A:T2) R218.1
V+: D43.1(+) Q24.3(E) Q27.3(E) Q32.3(E) SJMP3.1 X7.6 ; also sheet 2
VCC: 6V3.TP(PP) C29.1 IC22.3(P:V+) IC23.1(OUT) IC27.8(P:V+) R175.2 R178.2 R181.1 R188.2 R207.2 ; also sheet 2
Unconnected: IC19.4(Q7) IC19.5(Q9) IC19.7(Q6) IC19.9(Q8) IC24.7(DIS) IC25.7(A:!Q) IC25.10(B:Q) X7.20 X7.24

### Notes on the sheet
- Externe Beschaltung
- Variante "eine LED leuchtet"
- Variante "alle LEDs bis und
   mit Gang X leuchten"
- Anzeige:
- Klemmleisten
  Ausgang:
- Gang 1
- DauerPlus
  Konstant-Strom für LEDs
  Gang 1
  Gang 2
  Gang 3
  Gang 4
  Gang 5
  Neutrallampe
  Blinker rechts
  Blinker zusammen
  Blinker links
  Masse
- Gang 1
- Gang 2
- Gang 2
- Gang 3
- Gang 3
- Gang 1 | Gang 2 | Gang 3 | Gang 4 | Gang 5
- Gang 4
- Gang 4 | Klemmleisten Ausgang:
- Gang 5
- Gang 5
- Zündugsplus
  Choke
  Öldrucklampe
  Temperaturlampe
  Ladekontrolllampe
  Tankgeber (100hm)
  ABS-Lampe
  Lampentest
  Warnlampe
  Fernlichtlampe
  Geschwindigkeitssignal
  Menütaster
- Stromquelle für Gang
  LEDs. Für mehr als 12mA
  muss ein Widerstand "R_user"
  eingelötet werden. Für weniger
  muss der 1kOhm SMD Widerstand
  neben R_user entfernt werden
  I = 12V/1kOhm(default)+12V/R_user
  I= 12mA (default) + 12V/R_user
  Beispiel:
  R_user      Strom in LEDs
  1 kOhm     22-26mA
  ohne       11-13mA
- Externe Beschaltung
- an Zündungsplus anhängen
  (Neutral leuchtet wenn Gang 0
  eingelegt und Zündschlüssel steckt )
- Neutrallampe
  für eigene
  Ganganzeige
- DauerPlus Batterie 12V (rot weiss)
  Ganganzeige Signal C (gelb weiss)
  Ganganzeige Signal B (gelb schwarz)
  Ganganzeige Signal A (gelb dunkelblau)
  12V/350mA zum Starknopf (schwarz grün)
  Zündungsplus 12V (grün schwarz)
  Reservelampe (weiss)
  ABS Leuchte (blau)
  Ladekontrollleuchte (schaltet auf Masse) (violett schwarz)
  Temperaturleuchte (schaltet auf Masse) (braun schwarz)
  Öldruckleuchte (schaltet auf Masse) (braun grün)
  Chokelampe (schaltet auf Masse) (violett weiss)
- BL resistors
- 1k
- an Ausgang "Neutrallampe" anhängen
- Masse (braun)
  Lampentest (schaltet auf Masse)(weiss blau)
  Fernlichtlampe (12V) (weiss)
  Drehzahl Zündspule (schwarz blau)
  Blinker rechts (blau scharz)
  Masse (braun)
  Blinker links (blau rot)
  nicht angeschlossen
  Tachosiganl zum Blinrelais (balu grün)
  Tachogeber (gelb)
  Masse Tachobeger (braun)
  Tachobeleuchtung (12V Zündungsplus) (grau blau)
- RES | BAR
- 4.7V | rising edge trigger A
- non retriggerable
- ZündungsPlus
- current source 96mA
- 6V regulated for Opamps
- nicht bestückt
- retriggerable
- Standard panel Fiducial | panel Fiducial with solder mask around fiducial

## Library data of the parts
1 2 7 8 = con WAGO BMW:2081-1132: WAGO SREW CLAMP
6V 6V3 10V 10V3 START START3 TP1-TP13 TP16-TP19 TP21-TP26 TP70-TP92 = testpin_BMW:TPS: TEST PIN
C2 C27 C28 C38 C107 C108 = Seeed-Capacitor-2016:CERAMIC-100UF-6.3V-20%-X5R(1206): 302010183; MPN: GRM31CR60J107ME39L; VALUE: 100uf
C15 C30 C37 C101 = Seeed-Capacitor-2016:CERAMIC-4.7UF-25V-10%-X5R(0805): 302010146; MPN: CC0805KKX5R8BB475; VALUE: 4.7uf
C29 C31-C36 C102-C106 C109 C110 = Seeed-Capacitor-2016:CERAMIC-100NF-50V-10%-X7R(0805): 302010165; MPN: CC0805KRX7R9BB104; VALUE: 100nf
C63 = rcl:C-EU: CAPACITOR, European symbol
D1 D2 D35-D38 D43 D44 D74 D107-D110 = Diode-do214ac:DIODE-GEN-PURPOSE-1KV-1A(DO-214AC): 304010013
D4 D45 = diode:CGRM400*-G: Molded plasitc,JEDEC SOD-123/Mini SMA Source: Comchip CGRM4001-G.pdf
D32-D34 D39 D102 D103 D105 D106 = Diode-do214ac:DIODE-GEN-PURPOSE-1KV-1A(DO-214AC): 304010013; MPN: 1N4007; VALUE: 1N4007
D40 D112 = Diode-do214ac:DIODE-GEN-PURPOSE-1KV-1A(DO-214AC): 304010013; MPN: 1N4007
D41 D42 D101 D104 = Suppressor_Diode_DO214AA:SM6T: Z DIODE
FID1 FID1B FID2 FID2B FID11-FID14 FID101-FID104 = Fiducial:FIDUCIAL: For use by pick and place machines to calibrate the vision/machine, 1mm By microbuilder.eu
IC19 IC105 = 4028:4028: BCD to decimal DECODER
IC20 IC109 = linear_BMW:*317: Positive VOLTAGE REGULATOR
IC21 IC107 = uln-udn:ULN2004A: DRIVER ARRAY
IC22 IC108 = LM339:LM339: Low Power Low Offset Voltage Quad Comparators with open collector; LM139/LM239/LM339/LM2901/LM3302
IC23 IC26 IC102 IC104 = 78LXX:78LXX
IC24 IC110 = linear:*555: TIMER
IC25 IC111 = 45xx:4538: Dual precision monostable MULTIVIBRATOR
IC27 IC101 = linear_BMW:LM358: OP AMP also LM158; LM258; LM2904 Source: http://cache.national.com/ds/LM/LM158.pdf
JP11 JP13-JP15 JP101-JP104 = Switch Aliexpress 2:JP2E: JUMPER
JP12 JP105 = Switch Aliexpress 2:JP2E_ORIG
LED13-LED18 LED101-LED106 = led:LED: LED OSRAM: - CHIPLED LG R971, LG N971, LY N971, LG Q971, LY Q971, LO R971, LY R971 LH N974, LH R974 LS Q976, LO Q976, LY Q976 LO Q996 - Hyper CHIPLED LW Q18S LB Q993, LB Q99A, LB R99A - SideLED LS A670, LO A670, LY A670, LG A670, LP A670 LB A673, LV A673, LT A673, LW A673 LH A674 LY A675 LS A676, LA A676, LO A676, LY A676, LW A676 LS A679, LY A679, LG A679 - Hyper Micro SIDELED® LS Y876, LA Y876, LO Y876, LY Y876 LT Y87S - SmartLED LW L88C, LW L88S LB L89C, LB L89S, LG L890 LS L89K, LO L89K, LY L89K LS L896, LA L896, LO L896, LY L896 - TOPLED LS T670, LO T670, LY T670, LG T670, LP T670 LSG T670, LSP T670, LSY T670, LOP T670, LYG T670 LG T671, LOG T671, LSG T671 LB T673, LV T673, LT T673, LW T673 LH T674 LS T676, LA T676, LO T676, LY T676, LB T676, LH T676, LSB T676, LW T676 LB T67C, LV T67C, LT T67C, LS T67K, LO T67K, LY T67K, LW E67C LS E67B, LA E67B, LO E67B, LY E67B, LB E67C, LV E67C, LT E67C LW T67C LS T679, LY T679, LG T679 LS T770, LO T770, LY T770, LG T770, LP T770 LB T773, LV T773, LT T773, LW T773 LH T774 LS E675, LA E675, LY E675, LS T675 LS T776, LA T776, LO T776, LY T776, LB T776 LHGB T686 LT T68C, LB T68C - Hyper Mini TOPLED® LB M676 - Mini TOPLED Santana® LG M470 LS M47K, LO M47K, LY M47K Source: http://www.osram.convergy.de LUXEON: - LUMILED® LXK2-PW12-R00, LXK2-PW12-S00, LXK2-PW14-U00, LXK2-PW14-V00 LXK2-PM12-R00, LXK2-PM12-S00, LXK2-PM14-U00 LXK2-PE12-Q00, LXK2-PE12-R00, LXK2-PE12-S00, LXK2-PE14-T00, LXK2-PE14-U00 LXK2-PB12-K00, LXK2-PB12-L00, LXK2-PB12-M00, LXK2-PB14-N00, LXK2-PB14-P00, LXK2-PB14-Q00 LXK2-PR12-L00, LXK2-PR12-M00, LXK2-PR14-Q00, LXK2-PR14-R00 LXK2-PD12-Q00, LXK2-PD12-R00, LXK2-PD12-S00 LXK2-PH12-R00, LXK2-PH12-S00 LXK2-PL12-P00, LXK2-PL12-Q00, LXK2-PL12-R00 Source: www.luxeon.com KINGBRIGHT: KA-3528ASYC Source: www.kingbright.com
Q1 Q3 Q29-Q31 Q33 Q106 Q107 = Seeed-Transistor-2016:SMD-MOSFET-N-CH-50V-200MA-BSS138W-7-F(SOT-23): 305030000; MPN: BSS138W-7-F; VALUE: BSS138W-7-F
Q2 Q24-Q27 Q32 Q101 Q102 Q104 Q105 = Transistor_SOT89:PNP-TRANSISTOR_: PNP TRANSISTOR
Q28 Q103 = Transistor_SOT89:NPN-TRANSISTOR_: NPN TRANSISTOR
R1-R3 R107-R111 R120 R121 R124 R125 R130-R132 R135 R140 R141 R144 R169-R171 R173-R179 R181 R195-R198 R204 R210-R212 = Seeed-Resistor-2016:SMD-RES-10K-1%-1/8W(0805): 301010361; MPN: RC0805FR-0710KL; VALUE: 10K
R4 R115 R186 R215 = Seeed-Resistor-2016:SMD-RES-220R-5%-1/8W(0805): 301010315; MPN: RC0805JR-07220RL; VALUE: 220R
R5 R9 R102 R106 R134 R167 R190 R191 R213 R216 = Seeed-Resistor-2016:SMD-RES-13R-5%-1/4W(1206): 301010405; MPN: RC1206JR-0713RL; VALUE: 13R
R6 R101 R112-R114 R128 R184 R189 R205 R207 R208 R214 = Seeed-Resistor-2016:SMD-RES-1K-5%-1/8W(0805): 301010311; MPN: RC0805JR-071KL; VALUE: 1K
R8 R10 R105 R116 R117 R122 R123 R126 R145 R146 R172 R182 R183 R192 R193 R201 R203 R206 R217 R218 = Seeed-Resistor-2016:SMD-RES-4.7K-5%-1/8W(0805): 301010306; MPN: RC0805JR-074K7L; VALUE: 4.7K
R12 R13 R119 R133 R138 R180 R194 R202 R219 R220 = Seeed-Resistor-2016:SMD-RES-2.2K-5%-1/8W(0805): 301010333; MPN: RC0805JR-072K2L; VALUE: 2.2K
R103 R104 R127 R129 R136 R137 R166 R168 R185 R199 R200 R209 = rcl:R-EU_: RESISTOR, European symbol
R142 R143 R187 R188 = Seeed-Resistor-2016:SMD-RES-100R-5%-1/8W(0805): 301010319; MPN: RC0805JR-07100RL; VALUE: 100R
SJ3 SJ101 = solder-jumper:SJ: SMD solder JUMPER
SJMP SJMP3 = jumper:SJ: SMD solder JUMPER
X7 X101 = con_BMW:CON_BMW: BMW CONNECTOR
X8 X103 = con_Molex_BMW:22-23-2051: .100" (2.54mm) Center Header - 5 Pin; MF: MOLEX; MPN: 22-23-2051; OC_FARNELL: 1462952; OC_NEWARK: 38C9178
X9 X102 = con_Molex_BMW:22-23-2021: .100" (2.54mm) Center Header - 2 Pin; MF: MOLEX; MPN: 22-23-2021; OC_FARNELL: 1462926; OC_NEWARK: 25C3832